# Altium schematic sheet EPS_3V3.SchDoc: 3V3
size A4; SheetNumber: 39; SheetTotal: 51
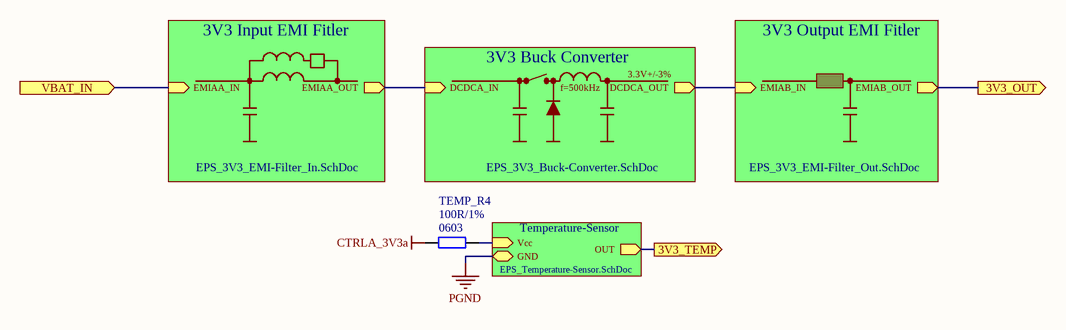
[diagram p0: EPS_3V3.SchDoc]

## Parts
TEMP_R4  Package: 0603  [SMD_Resistor_0603]  (hidden comment: 100R/1%)

## Sub-sheets
3V3 Buck Converter = EPS_3V3_Buck-Converter.SchDoc: DCDCA_IN (in), DCDCA_OUT (out)
3V3 Input EMI Fitler = EPS_3V3_EMI-Filter_In.SchDoc: EMIAA_IN (in), EMIAA_OUT (out)
3V3 Output EMI Fitler = EPS_3V3_EMI-Filter_Out.SchDoc: EMIAB_IN (in), EMIAB_OUT (out)
Temperature-Sensor = EPS_Temperature-Sensor.SchDoc: OUT (out), Vcc (in), GND

## Ports
3V3_OUT (out), 3V3_TEMP (out), VBAT_IN (in)

## Nets
CTRLA_3V3a: TEMP_R4.2
PGND: sheet Temperature-Sensor/GND
3V3_OUT: port 3V3_OUT, sheet 3V3 Output EMI Fitler/EMIAB_OUT
3V3_TEMP: port 3V3_TEMP, sheet Temperature-Sensor/OUT
VBAT_IN: port VBAT_IN, sheet 3V3 Input EMI Fitler/EMIAA_IN
NetTEMP_R4_1: TEMP_R4.1 ; sheet Temperature-Sensor/Vcc
(unnamed): sheet 3V3 Buck Converter/DCDCA_IN, sheet 3V3 Input EMI Fitler/EMIAA_OUT
(unnamed): sheet 3V3 Buck Converter/DCDCA_OUT, sheet 3V3 Output EMI Fitler/EMIAB_IN

## Notes on the sheet
- 3.3V+/-3%
- f=500kHz
- Title:
- Project:
- Author:
- Model:
- Document Number:
- Checked by:
- Rev:
- Date:
- Approved by:
- Sheet:
- of
- File name:

## Library data of the parts
TEMP_R4 = CRCW06031K00FKxxxx: 1k/1% Vishay CRCW 0603 Resistor. 100mW, 100ppm, 75V.; Manufacturer: Vishay; ManufacturerPartNumber: CRCW06031K00FKxxxx; Value: 100R/1%